# EAGLE schematic AllOfTheAbove_16nov (EAGLE 9.5.1)

## Sheet 1 of 4: Main 1-Inputs/VCAs
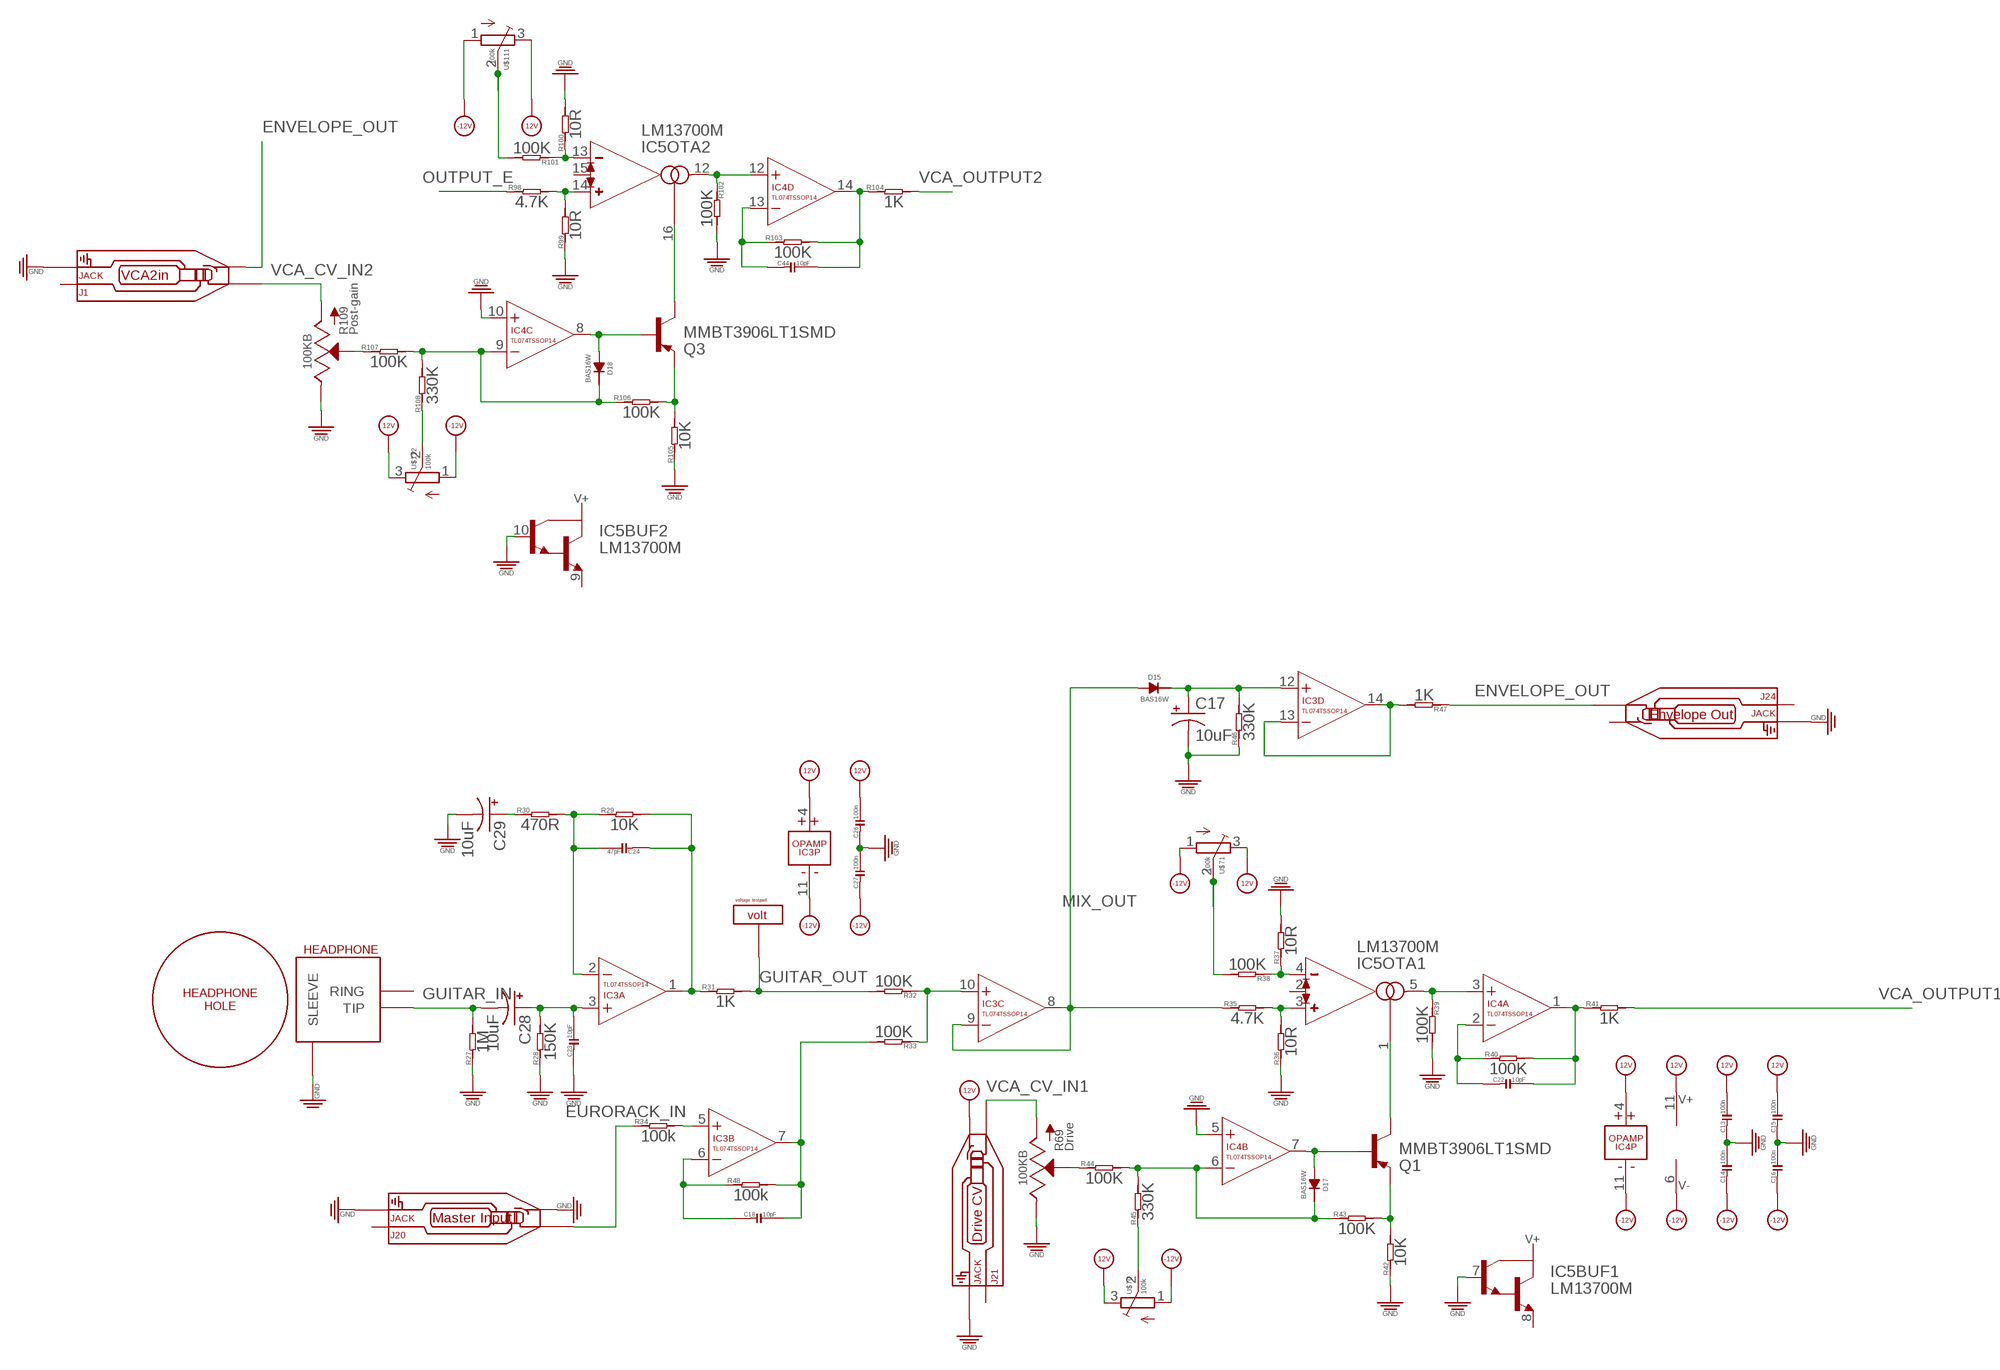
[diagram p0: schematic, sheet 1]

### Parts
C13  100n  C-0603  [C0603]
C14  100n  C-0603  [C0603]
C15  100n  C-0603  [C0603]
C16  100n  C-0603  [C0603]
C17  10uF  CPOL-US153CLV-0505  [153CLV-0505]
C18  10pF  C-0603  [C0603]
C22  10pF  C-0603  [C0603]
C23  10pF  C-0603  [C0603]
C24  47pF  C-0603  [C0603]
C26  100n  C-0603  [C0603]
C27  100n  C-0603  [C0603]
C28  10uF  CPOL-US153CLV-0505  [153CLV-0505]
C29  10uF  CPOL-US153CLV-0505  [153CLV-0505]
C44  10pF  C-0603  [C0603]
D15  BAS16W  [SOT-323]
D17  BAS16W  [SOT-323]
D18  BAS16W  [SOT-323]
IC3  TL074TSSOP14  [TSSOP14]
IC4  TL074TSSOP14  [TSSOP14]
IC5  LM13700M  [SO16]
J1  JACK  AUDIO-JACK_SMALLSYMBOLNODRILL  [3.5MM-JACK-SWITCH-13MM-NOHOLES]
J20  JACK  AUDIO-JACK_SMALLSYMBOLNODRILL  [3.5MM-JACK-SWITCH-13MM-NOHOLES]
J21  JACK  AUDIO-JACK_SMALLSYMBOLNODRILL  [3.5MM-JACK-SWITCH-13MM-NOHOLES]
J24  JACK  AUDIO-JACK_SMALLSYMBOLNODRILL  [3.5MM-JACK-SWITCH-13MM-NOHOLES]
Q1  MMBT3906LT1SMD  [SOT23-BEC]
Q3  MMBT3906LT1SMD  [SOT23-BEC]
R27  1M  R-0603  [R0603]
R28  150K  R-0603  [R0603]
R29  10K  R-0603  [R0603]
R30  470R  R-0603  [R0603]
R31  1K  R-0603  [R0603]
R32  100K  R-0603  [R0603]
R33  100K  R-0603  [R0603]
R34  100k  R-0603  [R0603]
R35  4.7K  R-0603  [R0603]
R36  10R  R-0603  [R0603]
R37  10R  R-0603  [R0603]
R38  100K  R-0603  [R0603]
R39  100K  R-0603  [R0603]
R40  100K  R-0603  [R0603]
R41  1K  R-0603  [R0603]
R42  10K  R-0603  [R0603]
R43  100K  R-0603  [R0603]
R44  100K  R-0603  [R0603]
R45  330K  R-0603  [R0603]
R46  330K  R-0603  [R0603]
R47  1K  R-0603  [R0603]
R48  100k  R-0603  [R0603]
R69  100KB  POTSQUAREHOLE_SMALLKNOB  [ALPS_POT_SQUAREHOLES]
R98  4.7K  R-0603  [R0603]
R99  10R  R-0603  [R0603]
R100  10R  R-0603  [R0603]
R101  100K  R-0603  [R0603]
R102  100K  R-0603  [R0603]
R103  100K  R-0603  [R0603]
R104  1K  R-0603  [R0603]
R105  10K  R-0603  [R0603]
R106  100K  R-0603  [R0603]
R107  100K  R-0603  [R0603]
R108  330K  R-0603  [R0603]
R109  100KB  POTSQUAREHOLE_SMALLKNOB  [ALPS_POT_SQUAREHOLES]
U$15  VOLTAGETESTPAD  [POWERTESTPAD]
U$23  HEADPHONEHOLE_BIGGAP  [HEADPHONEHOLE_GAP]
U$68  HEADPHONE  [2X3-SHROUDED]
U$70  100k  TRIMPOTTC33X  [TC33X]
U$71  100k  TRIMPOTTC33X  [TC33X]
U$111  100k  TRIMPOTTC33X  [TC33X]
U$112  100k  TRIMPOTTC33X  [TC33X]

### Nets
12V [power]: C13.2 C15.2 C26.2 IC3.4(P:V+) IC4.4(P:V+) IC5.11(SUPPLY:V+) J21.SWITCH_B@1(SWITCH) J21.SWITCH_T@3(SWITCH) U$70.3(E) U$71.3(E) U$111.3(E) U$112.3(E) ; also sheet 2,3,4
-12V [power]: C14.1 C16.1 C27.1 IC3.11(P:V-) IC4.11(P:V-) IC5.6(SUPPLY:V-) U$70.1(A) U$71.1(A) U$111.1(A) U$112.1(A) ; also sheet 2,3,4
ENVELOPE_OUT: J1.SWITCH_B@1(SWITCH) J1.SWITCH_T@3(SWITCH) J24.TIP_B@1(TIP) J24.TIP_T@3(TIP) R47.1 ; also sheet 2
EURORACK_IN: J20.TIP_B@1(TIP) J20.TIP_T@3(TIP) R34.1
GND [power]: C13.1 C14.2 C15.1 C16.2 C17.- C23.1 C26.1 C27.2 C29.- IC4.5(B:+IN) IC4.10(C:+IN) IC5.7(BUF1:B) IC5.10(BUF2:B) J1.RING_B@1(RING) J1.RING_T@3(RING) J20.RING_B@1(RING) J20.RING_T@3(RING) J20.SWITCH_B@1(SWITCH) J20.SWITCH_T@3(SWITCH) J21.RING_B@1(RING) J21.RING_T@3(RING) J24.RING_B@1(RING) J24.RING_T@3(RING) R27.1 R28.1 R36.1 R37.2 R39.2 R42.1 R46.1 R69.P$1(E) R99.1 R100.2 R102.2 R105.1 R109.P$1(E) U$68.3(SLEEVE) U$68.4(SLEEVE) ; also sheet 2,3,4
GUITAR_IN: C28.- R27.2 U$68.5(TIP) U$68.6(TIP)
GUITAR_OUT: R31.2 R32.2 U$15.P$1(VOLTAGE) U$15.P$2(VOLTAGE) U$15.P$3(VOLTAGE)
MIX_OUT: D15.ANODE IC3.8(C:OUT) IC3.9(C:-IN) R35.1
N$14: C23.2 C28.+ IC3.3(A:+IN) R28.2
N$17: C24.1 IC3.1(A:OUT) R29.2 R31.1
N$44: C24.2 IC3.2(A:-IN) R29.1 R30.2
N$45: C29.+ R30.1
N$46: C18.2 IC3.7(B:OUT) R33.2 R48.2
N$47: IC3.5(B:+IN) R34.2
N$48: IC5.4(OTA1:IN_N) R37.1 R38.1
N$49: IC5.3(OTA1:IN_P) R35.2 R36.2
N$50: IC4.3(A:+IN) IC5.5(OTA1:OUT) R39.1
N$51: C22.1 IC4.2(A:-IN) R40.1
N$52: C22.2 IC4.1(A:OUT) R40.2 R41.1
N$53: R38.2 U$71.2(S)
N$54: D17.ANODE IC4.7(B:OUT) Q1.B
N$55: D17.CATHODE IC4.6(B:-IN) R43.1 R44.2 R45.2
N$56: Q1.E R42.2 R43.2
N$57: IC5.1(OTA1:I_BIAS) Q1.C
N$58: R45.1 U$70.2(S)
N$59: R44.1 R69.P$2(S)
N$60: IC3.13(D:-IN) IC3.14(D:OUT) R47.2
N$61: C17.+ D15.CATHODE IC3.12(D:+IN) R46.2
N$62: C18.1 IC3.6(B:-IN) R48.1
N$106: IC5.13(OTA2:IN_N) R100.1 R101.1
N$107: IC5.14(OTA2:IN_P) R98.2 R99.2
N$108: IC4.12(D:+IN) IC5.12(OTA2:OUT) R102.1
N$109: C44.1 IC4.13(D:-IN) R103.1
N$110: C44.2 IC4.14(D:OUT) R103.2 R104.1
N$111: R101.2 U$111.2(S)
N$112: D18.ANODE IC4.8(C:OUT) Q3.B
N$113: D18.CATHODE IC4.9(C:-IN) R106.1 R107.2 R108.2
N$114: Q3.E R105.2 R106.2
N$115: IC5.16(OTA2:I_BIAS) Q3.C
N$116: R108.1 U$112.2(S)
N$117: R107.1 R109.P$2(S)
OUTPUT_E: R98.1 ; also sheet 2
VCA_CV_IN1: J21.TIP_B@1(TIP) J21.TIP_T@3(TIP) R69.P$3(A)
VCA_CV_IN2: J1.TIP_B@1(TIP) J1.TIP_T@3(TIP) R109.P$3(A)
VCA_OUTPUT1: R41.2 ; also sheet 2,3
VCA_OUTPUT2: R104.2 ; also sheet 2,3
VCA_SIG_IN: IC3.10(C:+IN) R32.1 R33.1
Unconnected: IC5.2(OTA1:I_DIODE) IC5.8(BUF1:E) IC5.9(BUF2:E) IC5.15(OTA2:I_DIODE) J1.SECOND_B@1(SECOND) J1.SECOND_T@3(SECOND) J20.SECOND_B@1(SECOND) J20.SECOND_T@3(SECOND) J21.SECOND_B@1(SECOND) J21.SECOND_T@3(SECOND) J24.SECOND_B@1(SECOND) J24.SECOND_T@3(SECOND) J24.SWITCH_B@1(SWITCH) J24.SWITCH_T@3(SWITCH) U$68.1(RING) U$68.2(RING)

## Sheet 2 of 4: Main 2-Pedals/Outputs
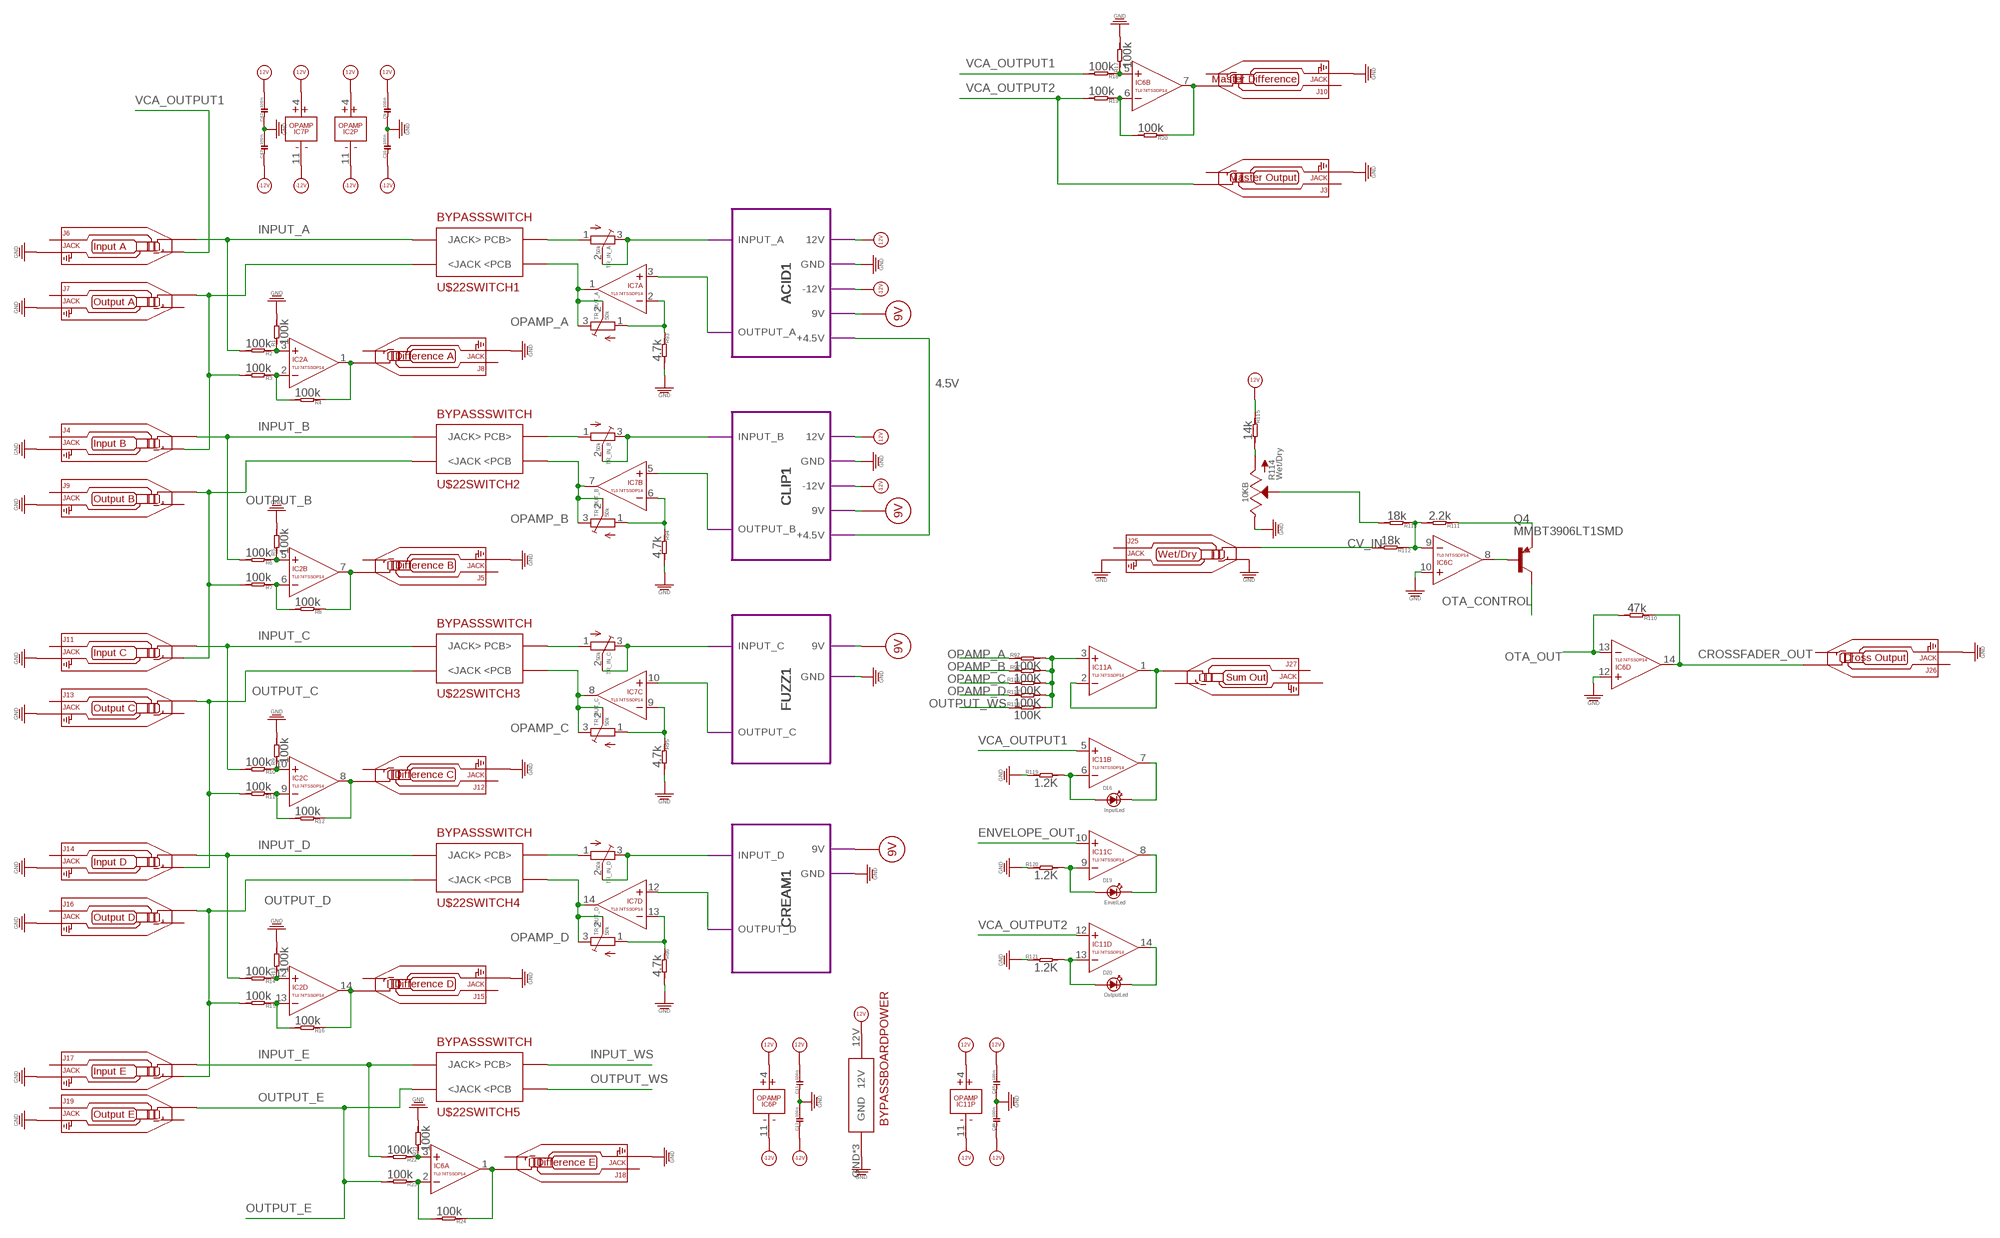
[diagram p1: schematic, sheet 2]

### Parts
C9  100n  C-0603  [C0603]
C10  100n  C-0603  [C0603]
C11  100n  C-0603  [C0603]
C12  100n  C-0603  [C0603]
C42  100n  C-0603  [C0603]
C43  100n  C-0603  [C0603]
C45  100n  C-0603  [C0603]
C46  100n  C-0603  [C0603]
D16  LED3MM  [3MMLED]
D19  LED3MM  [3MMLED]
D20  LED3MM  [3MMLED]
IC2  TL074TSSOP14  [TSSOP14]
IC6  TL074TSSOP14  [TSSOP14]
IC7  TL074TSSOP14  [TSSOP14]
IC11  TL074TSSOP14  [TSSOP14]
J3  JACK  AUDIO-JACK_SMALLSYMBOLNODRILL  [3.5MM-JACK-SWITCH-13MM-NOHOLES]
J4  JACK  AUDIO-JACK_SMALLSYMBOLNODRILL  [3.5MM-JACK-SWITCH-13MM-NOHOLES]
J5  JACK  AUDIO-JACK_SMALLSYMBOLNODRILL  [3.5MM-JACK-SWITCH-13MM-NOHOLES]
J6  JACK  AUDIO-JACK_SMALLSYMBOLNODRILL  [3.5MM-JACK-SWITCH-13MM-NOHOLES]
J7  JACK  AUDIO-JACK_SMALLSYMBOLNODRILL  [3.5MM-JACK-SWITCH-13MM-NOHOLES]
J8  JACK  AUDIO-JACK_SMALLSYMBOLNODRILL  [3.5MM-JACK-SWITCH-13MM-NOHOLES]
J9  JACK  AUDIO-JACK_SMALLSYMBOLNODRILL  [3.5MM-JACK-SWITCH-13MM-NOHOLES]
J10  JACK  AUDIO-JACK_SMALLSYMBOLNODRILL  [3.5MM-JACK-SWITCH-13MM-NOHOLES]
J11  JACK  AUDIO-JACK_SMALLSYMBOLNODRILL  [3.5MM-JACK-SWITCH-13MM-NOHOLES]
J12  JACK  AUDIO-JACK_SMALLSYMBOLNODRILL  [3.5MM-JACK-SWITCH-13MM-NOHOLES]
J13  JACK  AUDIO-JACK_SMALLSYMBOLNODRILL  [3.5MM-JACK-SWITCH-13MM-NOHOLES]
J14  JACK  AUDIO-JACK_SMALLSYMBOLNODRILL  [3.5MM-JACK-SWITCH-13MM-NOHOLES]
J15  JACK  AUDIO-JACK_SMALLSYMBOLNODRILL  [3.5MM-JACK-SWITCH-13MM-NOHOLES]
J16  JACK  AUDIO-JACK_SMALLSYMBOLNODRILL  [3.5MM-JACK-SWITCH-13MM-NOHOLES]
J17  JACK  AUDIO-JACK_SMALLSYMBOLNODRILL  [3.5MM-JACK-SWITCH-13MM-NOHOLES]
J18  JACK  AUDIO-JACK_SMALLSYMBOLNODRILL  [3.5MM-JACK-SWITCH-13MM-NOHOLES]
J19  JACK  AUDIO-JACK_SMALLSYMBOLNODRILL  [3.5MM-JACK-SWITCH-13MM-NOHOLES]
J25  JACK  AUDIO-JACK_SMALLSYMBOLNODRILL  [3.5MM-JACK-SWITCH-13MM-NOHOLES]
J26  JACK  AUDIO-JACK_SMALLSYMBOLNODRILL  [3.5MM-JACK-SWITCH-13MM-NOHOLES]
J27  JACK  AUDIO-JACK_SMALLSYMBOLNODRILL  [3.5MM-JACK-SWITCH-13MM-NOHOLES]
Q4  MMBT3906LT1SMD  [SOT23-BEC]
R1  100k  R-0603  [R0603]
R2  100k  R-0603  [R0603]
R3  100k  R-0603  [R0603]
R4  100k  R-0603  [R0603]
R5  100k  R-0603  [R0603]
R6  100k  R-0603  [R0603]
R7  100k  R-0603  [R0603]
R8  100k  R-0603  [R0603]
R9  100k  R-0603  [R0603]
R10  100k  R-0603  [R0603]
R11  100k  R-0603  [R0603]
R12  100k  R-0603  [R0603]
R13  100k  R-0603  [R0603]
R14  100k  R-0603  [R0603]
R15  100k  R-0603  [R0603]
R16  100k  R-0603  [R0603]
R17  100k  R-0603  [R0603]
R18  100k  R-0603  [R0603]
R19  100k  R-0603  [R0603]
R20  100k  R-0603  [R0603]
R21  100k  R-0603  [R0603]
R22  100k  R-0603  [R0603]
R23  100k  R-0603  [R0603]
R24  100k  R-0603  [R0603]
R92  100K  R-0603  [R0603]
R93  4.7k  R-0603  [R0603]
R94  4.7k  R-0603  [R0603]
R95  4.7k  R-0603  [R0603]
R96  4.7k  R-0603  [R0603]
R97  100K  R-0603  [R0603]
R110  47k  R-0603  [R0603]
R111  2.2k  R-0603  [R0603]
R112  18k  R-0603  [R0603]
R113  18k  R-0603  [R0603]
R114  10KB  POTSQUAREHOLE_SMALLKNOB  [ALPS_POT_SQUAREHOLES]
R115  14k  R-0603  [R0603]
R116  100K  R-0603  [R0603]
R117  100K  R-0603  [R0603]
R118  100K  R-0603  [R0603]
R119  1.2K  R-0603  [R0603]
R120  1.2K  R-0603  [R0603]
R121  1.2K  R-0603  [R0603]
TR_IN_A  50k  TRIMPOTTC33X  [TC33X]
TR_IN_B  50k  TRIMPOTTC33X  [TC33X]
TR_IN_C  50k  TRIMPOTTC33X  [TC33X]
TR_IN_D  50k  TRIMPOTTC33X  [TC33X]
TR_OUT_A  50k  TRIMPOTTC33X  [TC33X]
TR_OUT_B  50k  TRIMPOTTC33X  [TC33X]
TR_OUT_C  50k  TRIMPOTTC33X  [TC33X]
TR_OUT_D  50k  TRIMPOTTC33X  [TC33X]
U$22  5STOMPBOARD  [BYPASSBOARD]

### Module instances
ACID1 = ACID
CLIP1 = CLIP
FUZZ1 = FUZZ
CREAM1 = CREAM

### Nets
4.5V [power]: port ACID1.+4.5V CLIP1.+4.5V ; also sheet 4
9V [power]: port ACID1.9V CLIP1.9V FUZZ1.9V CREAM1.9V ; also sheet 4
12V [power]: C9.2 C11.2 C42.2 C45.2 IC2.4(P:V+) IC6.4(P:V+) IC7.4(P:V+) IC11.4(P:V+) R115.1 U$22.12V ; port CLIP1.12V ACID1.12V ; also sheet 1,3,4
-12V [power]: C10.1 C12.1 C43.1 C46.1 IC2.11(P:V-) IC6.11(P:V-) IC7.11(P:V-) IC11.11(P:V-) ; port CLIP1.-12V ACID1.-12V ; also sheet 1,3,4
CROSSFADER_OUT: IC6.14(D:OUT) J26.TIP_B@1(TIP) J26.TIP_T@3(TIP) R110.1
CV_IN: J25.TIP_B@1(TIP) J25.TIP_T@3(TIP) R112.2
ENVELOPE_OUT: IC11.10(C:+IN) ; also sheet 1
GND [power]: C9.1 C10.2 C11.1 C12.2 C42.1 C43.2 C45.1 C46.2 IC6.10(C:+IN) IC6.12(D:+IN) J3.RING_B@1(RING) J3.RING_T@3(RING) J4.RING_B@1(RING) J4.RING_T@3(RING) J5.RING_B@1(RING) J5.RING_T@3(RING) J6.RING_B@1(RING) J6.RING_T@3(RING) J7.RING_B@1(RING) J7.RING_T@3(RING) J8.RING_B@1(RING) J8.RING_T@3(RING) J9.RING_B@1(RING) J9.RING_T@3(RING) J10.RING_B@1(RING) J10.RING_T@3(RING) J11.RING_B@1(RING) J11.RING_T@3(RING) J12.RING_B@1(RING) J12.RING_T@3(RING) J13.RING_B@1(RING) J13.RING_T@3(RING) J14.RING_B@1(RING) J14.RING_T@3(RING) J15.RING_B@1(RING) J15.RING_T@3(RING) J16.RING_B@1(RING) J16.RING_T@3(RING) J17.RING_B@1(RING) J17.RING_T@3(RING) J18.RING_B@1(RING) J18.RING_T@3(RING) J19.RING_B@1(RING) J19.RING_T@3(RING) J25.RING_B@1(RING) J25.RING_T@3(RING) J25.SWITCH_B@1(SWITCH) J25.SWITCH_T@3(SWITCH) J26.RING_B@1(RING) J26.RING_T@3(RING) R1.2 R5.2 R9.2 R13.2 R17.2 R21.2 R93.2 R94.2 R95.2 R96.2 R114.P$1(E) R119.1 R120.1 R121.1 U$22.GND U$22.GND2(GND) U$22.GND3(GND) ; port ACID1.GND CLIP1.GND FUZZ1.GND CREAM1.GND ; also sheet 1,3,4
INPUT_A: J6.TIP_B@1(TIP) J6.TIP_T@3(TIP) R2.2 U$22.P$3(SWITCH1:JACK>)
INPUT_B: J4.TIP_B@1(TIP) J4.TIP_T@3(TIP) R6.2 U$22.P$7(SWITCH2:JACK>)
INPUT_C: J11.TIP_B@1(TIP) J11.TIP_T@3(TIP) R10.2 U$22.P$11(SWITCH3:JACK>)
INPUT_D: J14.TIP_B@1(TIP) J14.TIP_T@3(TIP) R14.2 U$22.P$15(SWITCH4:JACK>)
INPUT_E: J17.TIP_B@1(TIP) J17.TIP_T@3(TIP) R22.2 U$22.P$19(SWITCH5:JACK>)
INPUT_WS: U$22.P$20(SWITCH5:PCB>) ; also sheet 3
N$1: IC7.2(A:-IN) R93.1 TR_OUT_A.1(A)
N$4: IC11.1(A:OUT) IC11.2(A:-IN) J27.TIP_B@1(TIP) J27.TIP_T@3(TIP)
N$5: TR_IN_A.1(A) U$22.P$4(SWITCH1:PCB>)
N$6: IC7.3(A:+IN) ; port ACID1.OUTPUT_A
N$7: TR_IN_B.1(A) U$22.P$8(SWITCH2:PCB>)
N$8: TR_IN_C.1(A) U$22.P$12(SWITCH3:PCB>)
N$9: TR_IN_C.2(S) TR_IN_C.3(E) ; port FUZZ1.INPUT_C
N$10: IC11.3(A:+IN) R92.2 R97.2 R116.2 R117.2 R118.2
N$11: IC7.9(C:-IN) R95.1 TR_OUT_C.1(A)
N$12: TR_IN_B.2(S) TR_IN_B.3(E) ; port CLIP1.INPUT_B
N$13: D16.+ IC11.6(B:-IN) R119.2
N$15: IC2.3(A:+IN) R1.1 R2.1
N$16: IC6.9(C:-IN) R111.2 R112.1 R113.1
N$18: IC2.1(A:OUT) J8.TIP_B@1(TIP) J8.TIP_T@3(TIP) R4.1
N$19: IC2.5(B:+IN) R5.1 R6.1
N$20: IC2.6(B:-IN) R7.1 R8.2
N$21: Q4.E R111.1
N$22: IC6.8(C:OUT) Q4.B
N$23: IC2.7(B:OUT) J5.TIP_B@1(TIP) J5.TIP_T@3(TIP) R8.1
N$24: IC2.10(C:+IN) R9.1 R10.1
N$25: IC2.9(C:-IN) R11.1 R12.2
N$26: R114.P$3(A) R115.2
N$27: R113.2 R114.P$2(S)
N$28: IC2.8(C:OUT) J12.TIP_B@1(TIP) J12.TIP_T@3(TIP) R12.1
N$29: IC2.12(D:+IN) R13.1 R14.1
N$30: IC2.13(D:-IN) R15.1 R16.2
N$31: IC7.6(B:-IN) R94.1 TR_OUT_B.1(A)
N$32: D16.- IC11.7(B:OUT)
N$33: IC2.14(D:OUT) J15.TIP_B@1(TIP) J15.TIP_T@3(TIP) R16.1
N$34: IC6.5(B:+IN) R17.1 R18.1
N$35: IC6.6(B:-IN) R19.1 R20.2
N$36: D19.+ IC11.9(C:-IN) R120.2
N$37: IC7.5(B:+IN) ; port CLIP1.OUTPUT_B
N$38: IC6.7(B:OUT) J10.TIP_B@1(TIP) J10.TIP_T@3(TIP) R20.1
N$39: IC6.3(A:+IN) R21.1 R22.1
N$40: IC6.2(A:-IN) R23.1 R24.2
N$41: TR_IN_A.2(S) TR_IN_A.3(E) ; port ACID1.INPUT_A
N$42: D19.- IC11.8(C:OUT)
N$43: IC6.1(A:OUT) J18.TIP_B@1(TIP) J18.TIP_T@3(TIP) R24.1
N$99: TR_IN_D.1(A) U$22.P$16(SWITCH4:PCB>)
N$100: TR_IN_D.2(S) TR_IN_D.3(E) ; port CREAM1.INPUT_D
N$101: IC7.13(D:-IN) R96.1 TR_OUT_D.1(A)
N$102: IC7.12(D:+IN) ; port CREAM1.OUTPUT_D
N$103: IC7.10(C:+IN) ; port FUZZ1.OUTPUT_C
N$104: D20.+ IC11.13(D:-IN) R121.2
N$105: D20.- IC11.14(D:OUT)
N$118: IC2.2(A:-IN) R3.1 R4.2
OPAMP_A: IC7.1(A:OUT) R92.1 TR_OUT_A.2(S) TR_OUT_A.3(E) U$22.P$2(SWITCH1:<PCB)
OPAMP_B: IC7.7(B:OUT) R97.1 TR_OUT_B.2(S) TR_OUT_B.3(E) U$22.P$6(SWITCH2:<PCB)
OPAMP_C: IC7.8(C:OUT) R116.1 TR_OUT_C.2(S) TR_OUT_C.3(E) U$22.P$10(SWITCH3:<PCB)
OPAMP_D: IC7.14(D:OUT) R117.1 TR_OUT_D.2(S) TR_OUT_D.3(E) U$22.P$14(SWITCH4:<PCB)
OTA_CONTROL: Q4.C ; also sheet 3
OTA_OUT: IC6.13(D:-IN) R110.2 ; also sheet 3
OUTPUT_A: J4.SWITCH_B@1(SWITCH) J4.SWITCH_T@3(SWITCH) J7.TIP_B@1(TIP) J7.TIP_T@3(TIP) R3.2 U$22.P$1(SWITCH1:<JACK)
OUTPUT_B: J9.TIP_B@1(TIP) J9.TIP_T@3(TIP) J11.SWITCH_B@1(SWITCH) J11.SWITCH_T@3(SWITCH) R7.2 U$22.P$5(SWITCH2:<JACK)
OUTPUT_C: J13.TIP_B@1(TIP) J13.TIP_T@3(TIP) J14.SWITCH_B@1(SWITCH) J14.SWITCH_T@3(SWITCH) R11.2 U$22.P$9(SWITCH3:<JACK)
OUTPUT_D: J16.TIP_B@1(TIP) J16.TIP_T@3(TIP) J17.SWITCH_B@1(SWITCH) J17.SWITCH_T@3(SWITCH) R15.2 U$22.P$13(SWITCH4:<JACK)
OUTPUT_E: J19.TIP_B@1(TIP) J19.TIP_T@3(TIP) R23.2 U$22.P$17(SWITCH5:<JACK) ; also sheet 1
OUTPUT_WS: R118.1 U$22.P$18(SWITCH5:<PCB) ; also sheet 3
VCA_OUTPUT1: IC11.5(B:+IN) J6.SWITCH_B@1(SWITCH) J6.SWITCH_T@3(SWITCH) R18.2 ; also sheet 1,3
VCA_OUTPUT2: IC11.12(D:+IN) J3.TIP_B@1(TIP) J3.TIP_T@3(TIP) R19.2 ; also sheet 1,3
Unconnected: J3.SECOND_B@1(SECOND) J3.SECOND_T@3(SECOND) J3.SWITCH_B@1(SWITCH) J3.SWITCH_T@3(SWITCH) J4.SECOND_B@1(SECOND) J4.SECOND_T@3(SECOND) J5.SECOND_B@1(SECOND) J5.SECOND_T@3(SECOND) J5.SWITCH_B@1(SWITCH) J5.SWITCH_T@3(SWITCH) J6.SECOND_B@1(SECOND) J6.SECOND_T@3(SECOND) J7.SECOND_B@1(SECOND) J7.SECOND_T@3(SECOND) J7.SWITCH_B@1(SWITCH) J7.SWITCH_T@3(SWITCH) J8.SECOND_B@1(SECOND) J8.SECOND_T@3(SECOND) J8.SWITCH_B@1(SWITCH) J8.SWITCH_T@3(SWITCH) J9.SECOND_B@1(SECOND) J9.SECOND_T@3(SECOND) J9.SWITCH_B@1(SWITCH) J9.SWITCH_T@3(SWITCH) J10.SECOND_B@1(SECOND) J10.SECOND_T@3(SECOND) J10.SWITCH_B@1(SWITCH) J10.SWITCH_T@3(SWITCH) J11.SECOND_B@1(SECOND) J11.SECOND_T@3(SECOND) J12.SECOND_B@1(SECOND) J12.SECOND_T@3(SECOND) J12.SWITCH_B@1(SWITCH) J12.SWITCH_T@3(SWITCH) J13.SECOND_B@1(SECOND) J13.SECOND_T@3(SECOND) J13.SWITCH_B@1(SWITCH) J13.SWITCH_T@3(SWITCH) J14.SECOND_B@1(SECOND) J14.SECOND_T@3(SECOND) J15.SECOND_B@1(SECOND) J15.SECOND_T@3(SECOND) J15.SWITCH_B@1(SWITCH) J15.SWITCH_T@3(SWITCH) J16.SECOND_B@1(SECOND) J16.SECOND_T@3(SECOND) J16.SWITCH_B@1(SWITCH) J16.SWITCH_T@3(SWITCH) J17.SECOND_B@1(SECOND) J17.SECOND_T@3(SECOND) J18.SECOND_B@1(SECOND) J18.SECOND_T@3(SECOND) J18.SWITCH_B@1(SWITCH) J18.SWITCH_T@3(SWITCH) J19.SECOND_B@1(SECOND) J19.SECOND_T@3(SECOND) J19.SWITCH_B@1(SWITCH) J19.SWITCH_T@3(SWITCH) J25.SECOND_B@1(SECOND) J25.SECOND_T@3(SECOND) J26.SECOND_B@1(SECOND) J26.SECOND_T@3(SECOND) J26.SWITCH_B@1(SWITCH) J26.SWITCH_T@3(SWITCH) J27.RING_B@1(RING) J27.RING_T@3(RING) J27.SECOND_B@1(SECOND) J27.SECOND_T@3(SECOND) J27.SWITCH_B@1(SWITCH) J27.SWITCH_T@3(SWITCH)

## Sheet 3 of 4: Main 3-Folder/Crossfader
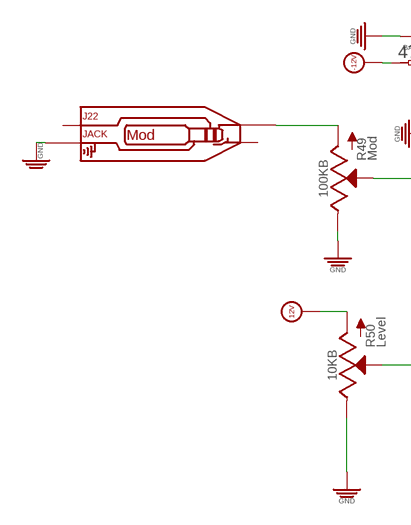
[diagram p2: schematic, sheet 3, part 1 of 3]
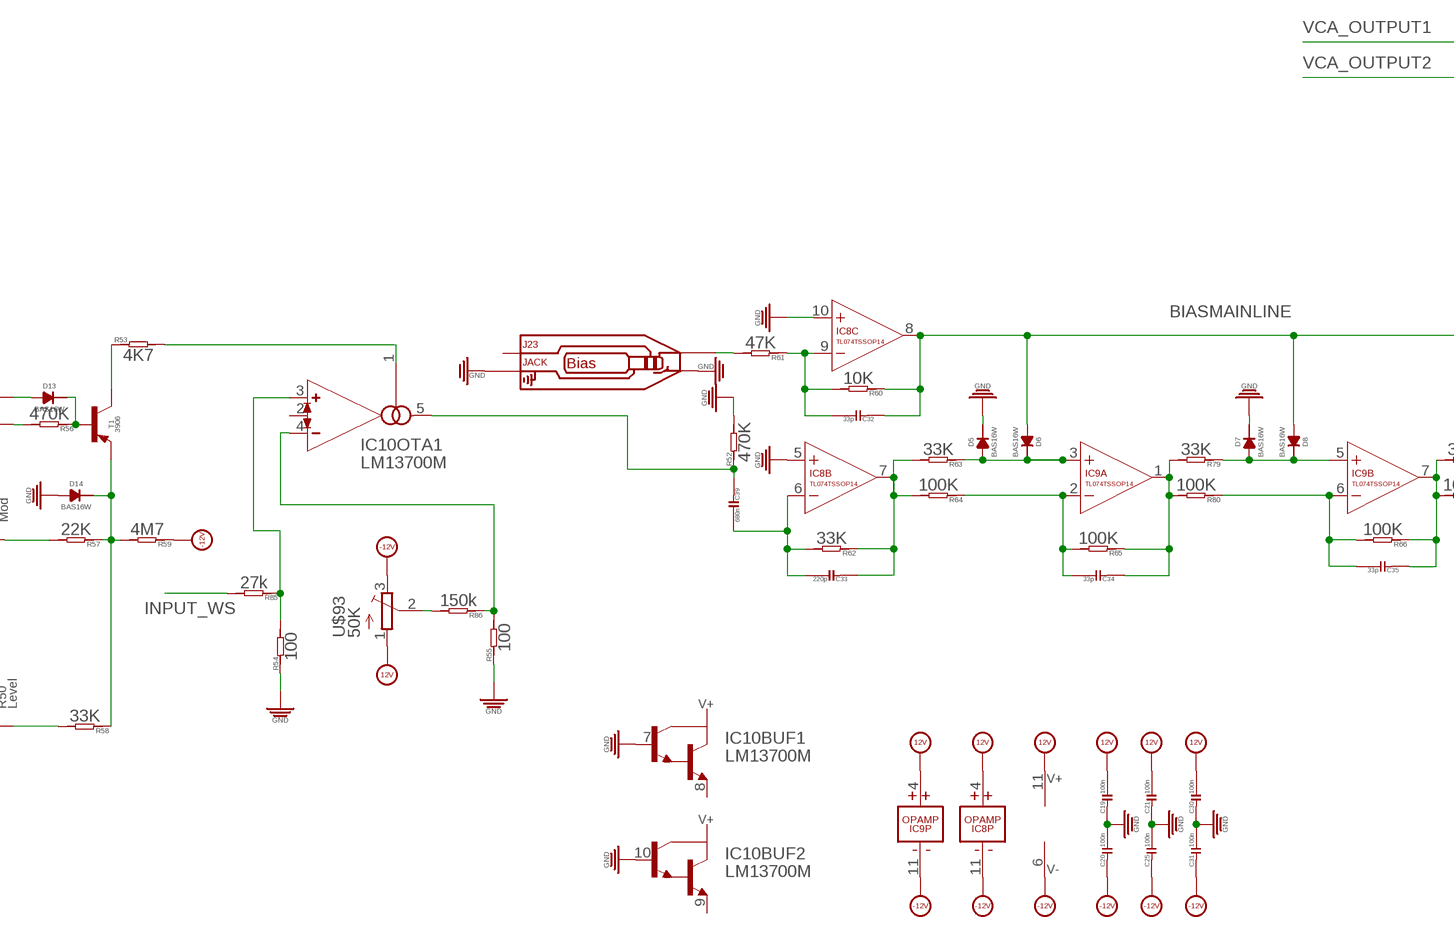
[diagram p3: schematic, sheet 3, part 2 of 3]
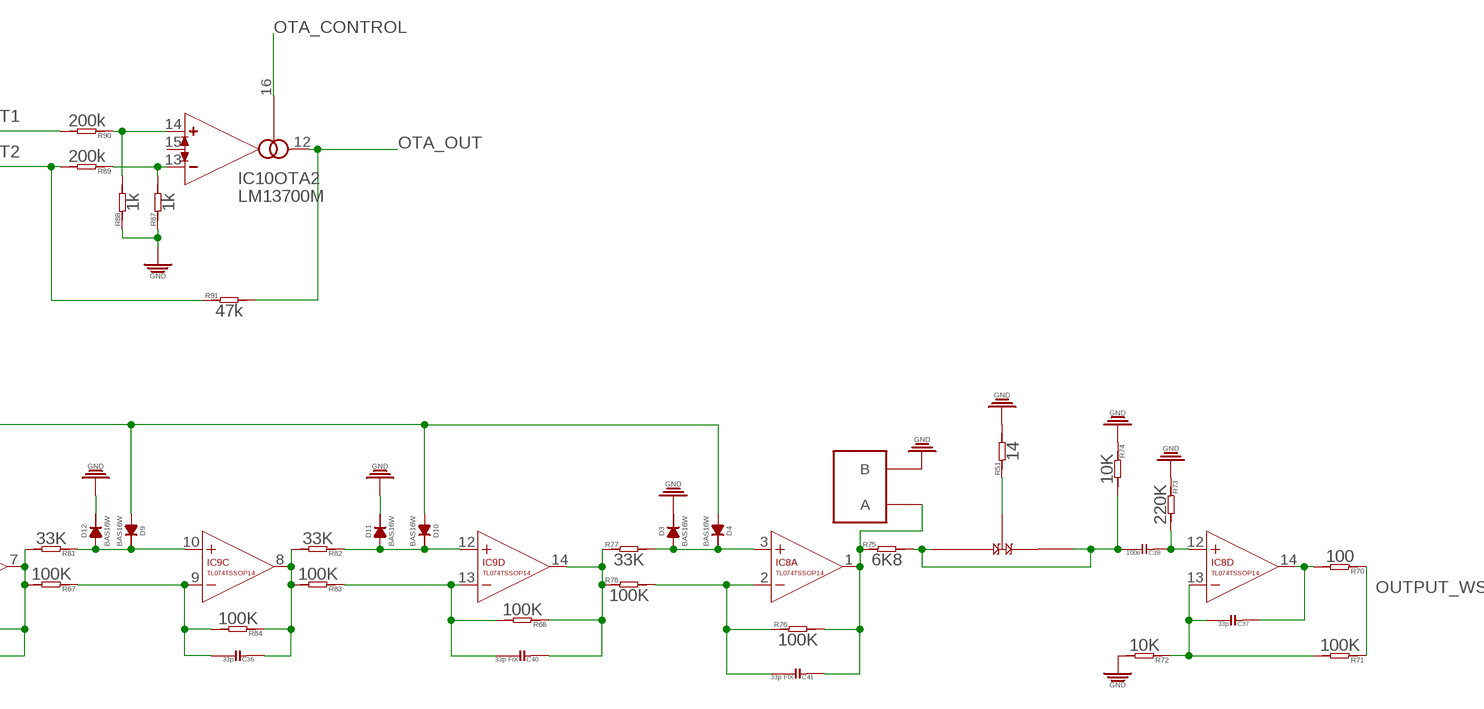
[diagram p4: schematic, sheet 3, part 3 of 3]

### Parts
C19  100n  C-0603  [C0603]
C20  100n  C-0603  [C0603]
C21  100n  C-0603  [C0603]
C25  100n  C-0603  [C0603]
C30  100n  C-0603  [C0603]
C31  100n  C-0603  [C0603]
C32  33p  C-0603  [C0603]
C33  220p  C-0603  [C0603]
C34  33p  C-0603  [C0603]
C35  33p  C-0603  [C0603]
C36  33p  C-0603  [C0603]
C37  33p  C-0603  [C0603]
C38  100n  C-0603  [C0603]
C39  680n  C-0603  [C0603]
C40  33p FIX  C-0603  [C0603]
C41  33p FIX  C-0603  [C0603]
D3  BAS16W  [SOT-323]
D4  BAS16W  [SOT-323]
D5  BAS16W  [SOT-323]
D6  BAS16W  [SOT-323]
D7  BAS16W  [SOT-323]
D8  BAS16W  [SOT-323]
D9  BAS16W  [SOT-323]
D10  BAS16W  [SOT-323]
D11  BAS16W  [SOT-323]
D12  BAS16W  [SOT-323]
D13  BAS16W  [SOT-323]
D14  BAS16W  [SOT-323]
IC8  TL074TSSOP14  [TSSOP14]
IC9  TL074TSSOP14  [TSSOP14]
IC10  LM13700M  [SO16]
J22  JACK  AUDIO-JACK_SMALLSYMBOLNODRILL  [3.5MM-JACK-SWITCH-13MM-NOHOLES]
J23  JACK  AUDIO-JACK_SMALLSYMBOLNODRILL  [3.5MM-JACK-SWITCH-13MM-NOHOLES]
R49  100KB  POTSQUAREHOLE_SMALLKNOB  [ALPS_POT_SQUAREHOLES]
R50  10KB  POTSQUAREHOLE_SMALLKNOB  [ALPS_POT_SQUAREHOLES]
R51  14  R-0603  [R0603]
R52  470K  R-0603  [R0603]
R53  4K7  R-0603  [R0603]
R54  100  R-0603  [R0603]
R55  100  R-0603  [R0603]
R56  470K  R-0603  [R0603]
R57  22K  R-0603  [R0603]
R58  33K  R-0603  [R0603]
R59  4M7  R-0603  [R0603]
R60  10K  R-0603  [R0603]
R61  47K  R-0603  [R0603]
R62  33K  R-0603  [R0603]
R63  33K  R-0603  [R0603]
R64  100K  R-0603  [R0603]
R65  100K  R-0603  [R0603]
R66  100K  R-0603  [R0603]
R67  100K  R-0603  [R0603]
R68  100K  R-0603  [R0603]
R70  100  R-0603  [R0603]
R71  100K  R-0603  [R0603]
R72  10K  R-0603  [R0603]
R73  220K  R-0603  [R0603]
R74  10K  R-0603  [R0603]
R75  6K8  R-0603  [R0603]
R76  100K  R-0603  [R0603]
R77  33K  R-0603  [R0603]
R78  100K  R-0603  [R0603]
R79  33K  R-0603  [R0603]
R80  100K  R-0603  [R0603]
R81  33K  R-0603  [R0603]
R82  33K  R-0603  [R0603]
R83  100K  R-0603  [R0603]
R84  100K  R-0603  [R0603]
R85  27k  R-0603  [R0603]
R86  150k  R-0603  [R0603]
R87  1k  R-0603  [R0603]
R88  1k  R-0603  [R0603]
R89  200k  R-0603  [R0603]
R90  200k  R-0603  [R0603]
R91  47k  R-0603  [R0603]
T1  3906  MMBT3906LT1-PNP-SOT23-BEC  [SOT23-BEC]
U$74  BAT54S  [SOT23]
U$92  TESTPOINT_DUAL_PTH  [TESTPAD_DUAL_PTH]
U$93  50K  TRIMPOTTC33X  [TC33X]

### Nets
12V [power]: C19.2 C21.2 C30.2 IC8.4(P:V+) IC9.4(P:V+) IC10.11(SUPPLY:V+) R50.P$3(A) U$93.1(A) ; also sheet 1,2,4
-12V [power]: C20.1 C25.1 C31.1 IC8.11(P:V-) IC9.11(P:V-) IC10.6(SUPPLY:V-) R56.2 R59.1 U$93.3(E) ; also sheet 1,2,4
BIASINPUT: J23.TIP_B@1(TIP) J23.TIP_T@3(TIP) R61.2
BIASMAINLINE: C32.1 D4.ANODE D6.ANODE D8.ANODE D9.ANODE D10.ANODE IC8.8(C:OUT) R60.1
GND [power]: C19.1 C20.2 C21.1 C25.2 C30.1 C31.2 D3.CATHODE D5.CATHODE D7.CATHODE D11.CATHODE D12.CATHODE D13.ANODE D14.ANODE IC8.5(B:+IN) IC8.10(C:+IN) IC10.7(BUF1:B) IC10.10(BUF2:B) J22.RING_B@1(RING) J22.RING_T@3(RING) J23.RING_B@1(RING) J23.RING_T@3(RING) J23.SWITCH_B@1(SWITCH) J23.SWITCH_T@3(SWITCH) R49.P$1(E) R50.P$1(E) R51.2 R52.2 R54.1 R55.1 R72.2 R73.1 R74.1 R87.1 R88.1 U$92.P$2(B) ; also sheet 1,2,4
INPUT_WS: R85.2 ; also sheet 2
N$63: R51.1 U$74.P$3
N$64: C32.2 IC8.9(C:-IN) R60.2 R61.1
N$65: R49.P$2(S) R57.2
N$66: J22.TIP_B@1(TIP) J22.TIP_T@3(TIP) R49.P$3(A)
N$67: D14.CATHODE R57.1 R58.1 R59.2 T1.E
N$68: R50.P$2(S) R58.2
N$69: C38.2 R74.2 R75.2 U$74.P$1 U$74.P$2
N$70: C33.1 IC8.7(B:OUT) R62.1 R63.2 R64.2
N$71: C33.2 C39.2 IC8.6(B:-IN) R62.2
N$72: C39.1 IC10.5(OTA1:OUT) R52.1
N$73: D5.ANODE D6.CATHODE IC9.3(A:+IN) R63.1
N$74: C34.1 IC9.1(A:OUT) R65.1 R79.2 R80.2
N$75: D7.ANODE D8.CATHODE IC9.5(B:+IN) R79.1
N$76: C34.2 IC9.2(A:-IN) R64.1 R65.2
N$77: C35.2 IC9.6(B:-IN) R66.2 R80.1
N$78: C35.1 IC9.7(B:OUT) R66.1 R67.2 R81.2
N$79: D9.CATHODE D12.ANODE IC9.10(C:+IN) R81.1
N$80: C36.1 IC9.8(C:OUT) R82.2 R83.2 R84.1
N$81: C36.2 IC9.9(C:-IN) R67.1 R84.2
N$82: D10.CATHODE D11.ANODE IC9.12(D:+IN) R82.1
N$83: C40.2 IC9.13(D:-IN) R68.2 R83.1
N$84: C40.1 IC9.14(D:OUT) R68.1 R77.1 R78.1
N$85: D3.ANODE D4.CATHODE IC8.3(A:+IN) R77.2
N$86: C41.2 IC8.2(A:-IN) R76.1 R78.2
N$87: C41.1 IC8.1(A:OUT) R75.1 R76.2 U$92.P$1(A)
N$88: C38.1 IC8.12(D:+IN) R73.2
N$89: C37.1 IC8.14(D:OUT) R70.2
N$90: C37.2 IC8.13(D:-IN) R71.2 R72.1
N$91: D13.CATHODE R56.1 T1.B
N$92: R53.1 T1.C
N$93: IC10.1(OTA1:I_BIAS) R53.2
N$94: IC10.3(OTA1:IN_P) R54.2 R85.1
N$95: R86.2 U$93.2(S)
N$96: IC10.4(OTA1:IN_N) R55.2 R86.1
N$97: IC10.13(OTA2:IN_N) R87.2 R89.1
N$98: IC10.14(OTA2:IN_P) R88.2 R90.1
OTA_CONTROL: IC10.16(OTA2:I_BIAS) ; also sheet 2
OTA_OUT: IC10.12(OTA2:OUT) R91.2 ; also sheet 2
OUTPUT_WS: R70.1 R71.1 ; also sheet 2
VCA_OUTPUT1: R90.2 ; also sheet 1,2
VCA_OUTPUT2: R89.2 R91.1 ; also sheet 1,2
Unconnected: IC10.2(OTA1:I_DIODE) IC10.8(BUF1:E) IC10.9(BUF2:E) IC10.15(OTA2:I_DIODE) J22.SECOND_B@1(SECOND) J22.SECOND_T@3(SECOND) J22.SWITCH_B@1(SWITCH) J22.SWITCH_T@3(SWITCH) J23.SECOND_B@1(SECOND) J23.SECOND_T@3(SECOND)

## Sheet 4 of 4: Power
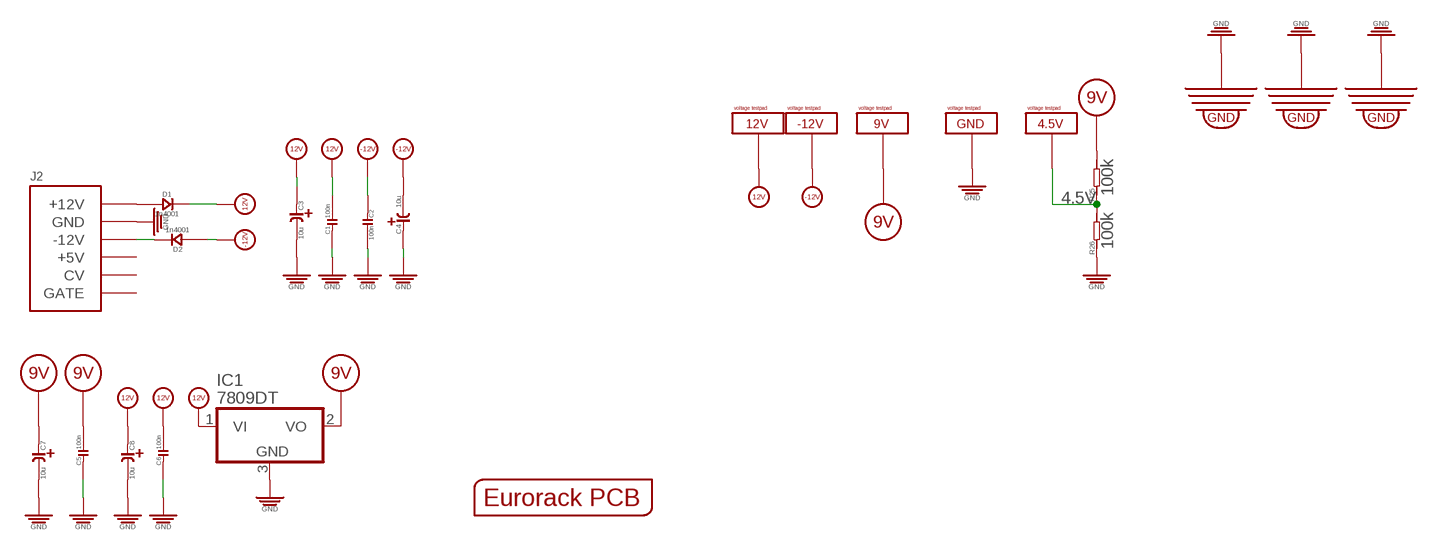
[diagram p5: schematic, sheet 4]

### Parts
C1  100n  C-0603  [C0603]
C2  100n  C-0603  [C0603]
C3  10u  C-POLAR-A  [CASE-A_3216]
C4  10u  C-POLAR-A  [CASE-A_3216]
C5  100n  C-0603  [C0603]
C6  100n  C-0603  [C0603]
C7  10u  C-POLAR-A  [CASE-A_3216]
C8  10u  C-POLAR-A  [CASE-A_3216]
D1  1n4001  D-SMA  [DO-214AC]
D2  1n4001  D-SMA  [DO-214AC]
IC1  7809DT  7805DT  [TO252]
J2  POWERSHROUDED  [POWER_16_SHROUDED]
PCB1  EURORACK_PCB5STOMP  [EURORACK36HP_5STOMP]
R25  100k  R-0603  [R0603]
R26  100k  R-0603  [R0603]
U$13  VOLTAGETESTPAD  [POWERTESTPAD]
U$41  VOLTAGETESTPAD  [POWERTESTPAD]
U$42  VOLTAGETESTPAD  [POWERTESTPAD]
U$43  VOLTAGETESTPAD  [POWERTESTPAD]
U$44  VOLTAGETESTPAD  [POWERTESTPAD]
U$48  GNDLOOP  [GROUNDLOOP]
U$49  GNDLOOP  [GROUNDLOOP]
U$50  GNDLOOP  [GROUNDLOOP]

### Nets
4.5V [power]: R25.1 R26.2 U$44.P$1(VOLTAGE) U$44.P$2(VOLTAGE) U$44.P$3(VOLTAGE) ; also sheet 2
9V [power]: C5.2 C7.+ IC1.2(VO) R25.2 U$42.P$1(VOLTAGE) U$42.P$2(VOLTAGE) U$42.P$3(VOLTAGE) ; also sheet 2
12V [power]: C1.2 C3.+ C6.2 C8.+ D1.2(-) IC1.1(VI) U$13.P$1(VOLTAGE) U$13.P$2(VOLTAGE) U$13.P$3(VOLTAGE) ; also sheet 1,2,3
-12V [power]: C2.1 C4.- D2.1(+) U$41.P$1(VOLTAGE) U$41.P$2(VOLTAGE) U$41.P$3(VOLTAGE) ; also sheet 1,2,3
GND [power]: C1.1 C2.2 C3.- C4.+ C5.1 C6.1 C7.- C8.- IC1.3(GND) J2.3(GND) J2.4(GND) J2.5(GND) J2.6(GND) J2.7(GND) J2.8(GND) R26.1 U$43.P$1(VOLTAGE) U$43.P$2(VOLTAGE) U$43.P$3(VOLTAGE) U$48.P$1 U$48.P$2 U$49.P$1 U$49.P$2 U$50.P$1 U$50.P$2 ; also sheet 1,2,3
N$2: D1.1(+) J2.9(+12V) J2.10(+12V)
N$3: D2.2(-) J2.1(-12V) J2.2(-12V)
Unconnected: J2.11(+5V) J2.12(+5V) J2.13(CV) J2.14(CV) J2.15(GATE) J2.16(GATE)

## Library data of the parts
C1 C2 C5 C6 C9-C16 C18-C27 C30-C46 = OPL:C*
C3 C4 C7 C8 = EurorackModularParts:C-POLAR*
C17 C28 C29 = adafruit@1:CPOL-US: POLARIZED CAPACITOR, American symbol
D1 D2 = OPL:D*: DIODE
D3-D15 D17 D18 = FenixBase:BAS16W
D16 = EurorackModularParts:LED*: LED; DESC: InputLed
D19 = EurorackModularParts:LED*: LED; DESC: EnvelLed
D20 = EurorackModularParts:LED*: LED; DESC: OutputLed
IC1 = adafruit:78*: Positive VOLTAGE REGULATOR Added bigger pads to the TO-92 package
IC2-IC4 IC6-IC9 IC11 = EurorackModularParts:TL074: OP AMP
IC5 IC10 = ota:LM13700: Dual OTA with buffers
J1 = EurorackModularParts:AUDIO-JACK_SMALLSYMBOL: Switching Mono 3.5mm Audio Jack from Erthenvar.; DESC: VCA2in
J2 = EurorackModularParts:POWER
J3 = EurorackModularParts:AUDIO-JACK_SMALLSYMBOL: Switching Mono 3.5mm Audio Jack from Erthenvar.; DESC: Master Output
J4 = EurorackModularParts:AUDIO-JACK_SMALLSYMBOL: Switching Mono 3.5mm Audio Jack from Erthenvar.; DESC: Input B
J5 = EurorackModularParts:AUDIO-JACK_SMALLSYMBOL: Switching Mono 3.5mm Audio Jack from Erthenvar.; DESC: Difference B
J6 = EurorackModularParts:AUDIO-JACK_SMALLSYMBOL: Switching Mono 3.5mm Audio Jack from Erthenvar.; DESC: Input A
J7 = EurorackModularParts:AUDIO-JACK_SMALLSYMBOL: Switching Mono 3.5mm Audio Jack from Erthenvar.; DESC: Output A
J8 = EurorackModularParts:AUDIO-JACK_SMALLSYMBOL: Switching Mono 3.5mm Audio Jack from Erthenvar.; DESC: Difference A
J9 = EurorackModularParts:AUDIO-JACK_SMALLSYMBOL: Switching Mono 3.5mm Audio Jack from Erthenvar.; DESC: Output B
J10 = EurorackModularParts:AUDIO-JACK_SMALLSYMBOL: Switching Mono 3.5mm Audio Jack from Erthenvar.; DESC: Master Difference
J11 = EurorackModularParts:AUDIO-JACK_SMALLSYMBOL: Switching Mono 3.5mm Audio Jack from Erthenvar.; DESC: Input C
J12 = EurorackModularParts:AUDIO-JACK_SMALLSYMBOL: Switching Mono 3.5mm Audio Jack from Erthenvar.; DESC: Difference C
J13 = EurorackModularParts:AUDIO-JACK_SMALLSYMBOL: Switching Mono 3.5mm Audio Jack from Erthenvar.; DESC: Output C
J14 = EurorackModularParts:AUDIO-JACK_SMALLSYMBOL: Switching Mono 3.5mm Audio Jack from Erthenvar.; DESC: Input D
J15 = EurorackModularParts:AUDIO-JACK_SMALLSYMBOL: Switching Mono 3.5mm Audio Jack from Erthenvar.; DESC: Difference D
J16 = EurorackModularParts:AUDIO-JACK_SMALLSYMBOL: Switching Mono 3.5mm Audio Jack from Erthenvar.; DESC: Output D
J17 = EurorackModularParts:AUDIO-JACK_SMALLSYMBOL: Switching Mono 3.5mm Audio Jack from Erthenvar.; DESC: Input E
J18 = EurorackModularParts:AUDIO-JACK_SMALLSYMBOL: Switching Mono 3.5mm Audio Jack from Erthenvar.; DESC: Difference E
J19 = EurorackModularParts:AUDIO-JACK_SMALLSYMBOL: Switching Mono 3.5mm Audio Jack from Erthenvar.; DESC: Output E
J20 = EurorackModularParts:AUDIO-JACK_SMALLSYMBOL: Switching Mono 3.5mm Audio Jack from Erthenvar.; DESC: Master Input
J21 = EurorackModularParts:AUDIO-JACK_SMALLSYMBOL: Switching Mono 3.5mm Audio Jack from Erthenvar.; DESC: Drive CV
J22 = EurorackModularParts:AUDIO-JACK_SMALLSYMBOL: Switching Mono 3.5mm Audio Jack from Erthenvar.; DESC: Mod
J23 = EurorackModularParts:AUDIO-JACK_SMALLSYMBOL: Switching Mono 3.5mm Audio Jack from Erthenvar.; DESC: Bias
J24 = EurorackModularParts:AUDIO-JACK_SMALLSYMBOL: Switching Mono 3.5mm Audio Jack from Erthenvar.; DESC: Envelope Out
J25 = EurorackModularParts:AUDIO-JACK_SMALLSYMBOL: Switching Mono 3.5mm Audio Jack from Erthenvar.; DESC: Wet/Dry
J26 = EurorackModularParts:AUDIO-JACK_SMALLSYMBOL: Switching Mono 3.5mm Audio Jack from Erthenvar.; DESC: Cross Output
J27 = EurorackModularParts:AUDIO-JACK_SMALLSYMBOL: Switching Mono 3.5mm Audio Jack from Erthenvar.; DESC: Sum Out
PCB1 = EurorackModularParts:EURORACK_PCB
Q1 Q3 Q4 = transistor-pnp:MMBT3906*: PNP Transistror
R1-R48 R51-R68 R70-R108 R110-R113 R115-R121 = OPL:R*
R49 = EurorackModularParts:POT; DESC: Mod
R50 = EurorackModularParts:POT; DESC: Level
R69 = EurorackModularParts:POT; DESC: Drive
R109 = EurorackModularParts:POT; DESC: Post-gain
R114 = EurorackModularParts:POT; DESC: Wet/Dry
T1 = transistor:*-PNP-: PNP Transistror
TR_IN_A TR_IN_B TR_IN_C TR_IN_D TR_OUT_A TR_OUT_B TR_OUT_C TR_OUT_D U$70 U$71 U$93 U$111 U$112 = adafruit:TRIMPOT: SMT trimmer potentiometer part number TC33X http://www.ladyada.net/library/eagle
U$13 = FenixBase:VOLTAGETESTPAD; DESC: 12V
U$15 = FenixBase:VOLTAGETESTPAD; DESC: volt
U$22 = EurorackModularParts:5STOMPBOARD
U$23 = EurorackModularParts:HEADPHONEHOLE
U$41 = FenixBase:VOLTAGETESTPAD; DESC: -12V
U$42 = FenixBase:VOLTAGETESTPAD; DESC: 9V
U$43 = FenixBase:VOLTAGETESTPAD; DESC: GND
U$44 = FenixBase:VOLTAGETESTPAD; DESC: 4.5V
U$48-U$50 = FenixBase:GNDLOOP
U$68 = SparkFun-Connectors:HEADPHONE
U$74 = FenixBase:BAT54S
U$92 = FenixBase:TESTPOINT_DUAL

## Module ACID
Ports: INPUT_A(io) OUTPUT_A(io) 12V(io) GND(io) -12V(io) 9V(io) +4.5V(io)
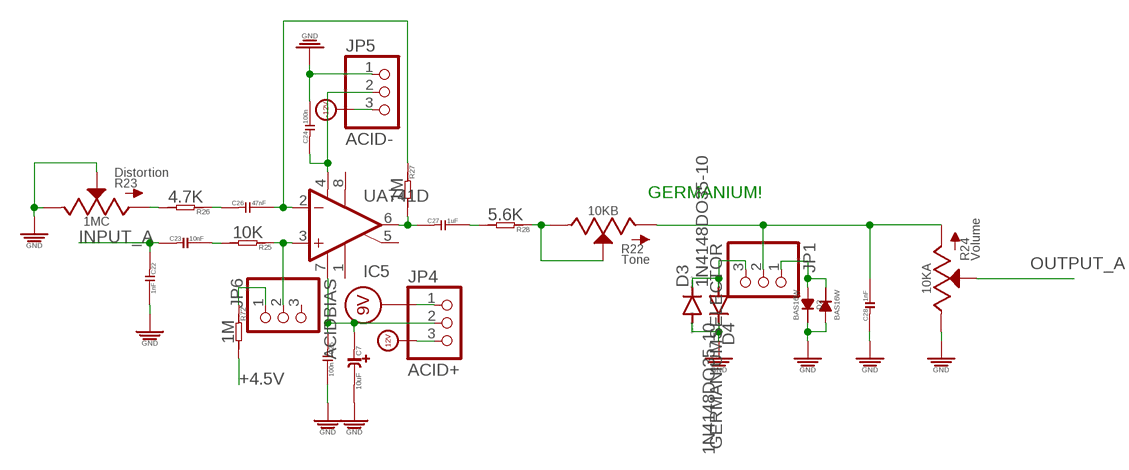
[diagram p6: schematic, module ACID, sheet 1]

### Parts
C7  10uF  C-POLAR-A  [CASE-A_3216]
C22  1nF  C-0603  [C0603]
C23  10nF  C-0603  [C0603]
C24  100n  C-0603  [C0603]
C25  100n  C-0603  [C0603]
C26  47nF  C-0603  [C0603]
C27  1uF  C-0603  [C0603]
C28  1nF  C-0603  [C0603]
D1  BAS16W  [SOT-323]
D2  BAS16W  [SOT-323]
D3  1N4148DO35-10  [DO35-10]
D4  1N4148DO35-10  [DO35-10]
IC5  UA741D  [SO08]
JP1  GERMANIUMSELECTOR  PINHD-1X3  [1X03]
JP4  ACID+  PINHD-1X3  [1X03]
JP5  ACID-  PINHD-1X3  [1X03]
JP6  ACIDBIAS  PINHD-1X3  [1X03]
R22  10KB  POTSQUAREHOLE_SMALLKNOB  [ALPS_POT_SQUAREHOLES]
R23  1MC  POTSQUAREHOLE_SMALLKNOB  [ALPS_POT_SQUAREHOLES]
R24  10KA  POTSQUAREHOLE_SMALLKNOB  [ALPS_POT_SQUAREHOLES]
R25  10K  R-0603  [R0603]
R26  4.7K  R-0603  [R0603]
R27  1M  R-0603  [R0603]
R28  5.6K  R-0603  [R0603]
R72  1M  R-0603  [R0603]

### Nets
9V: JP4.1
12V: JP4.3
+4.5V: R72.2
-12V: JP5.3
ACIDNE: C24.1 IC5.4(V-) JP5.2
ACIDPL: C7.+ C25.1 IC5.7(V+) JP4.2
ACIDVI: IC5.3(+IN) JP6.2 R25.1
GND: C7.- C22.2 C24.2 C25.2 C28.1 D1.ANODE D2.CATHODE D3.A D4.C JP5.1 R23.P$1(E) R23.P$2(S) R24.P$1(E)
INPUT_A: C22.1 C23.1
N$2: D3.C D4.A JP1.3
N$3: D1.CATHODE D2.ANODE JP1.1
N$20: C23.2 R25.2
N$22: C26.2 IC5.2(-IN) R27.1
N$23: C26.1 R26.1
N$32: C27.1 IC5.6(OUT) R27.2
N$33: R23.P$3(A) R26.2
N$34: C28.2 JP1.2 R22.P$3(A) R24.P$3(A)
N$35: C27.2 R28.2
N$36: R22.P$1(E) R22.P$2(S) R28.1
OUTPUT_A: R24.P$2(S)
TO4.5V: JP6.1 R72.1
Unconnected: IC5.1(ON1) IC5.5(ON2) IC5.8(OPT) JP6.3

### Notes on the sheet
- GERMANIUM!

### Library data of the parts
C7 = EurorackModularParts:C-POLAR*
C22-C28 = OPL:C*
D1 D2 = FenixBase:BAS16W
D3 D4 = diode:1N4148: DIODE high speed (Philips)
IC5 = linear:*741: OP AMP
JP1 = pinhead@1:PINHD-1X3: PIN HEADER
JP4-JP6 = pinhead:PINHD-1X3: PIN HEADER
R22 = EurorackModularParts:POT; DESC: Tone
R23 = EurorackModularParts:POT; DESC: Distortion
R24 = EurorackModularParts:POT; DESC: Volume
R25-R28 R72 = OPL:R*

## Module CLIP
Ports: INPUT_B(io) OUTPUT_B(io) 12V(io) GND(io) -12V(io) 9V(io) +4.5V(io)
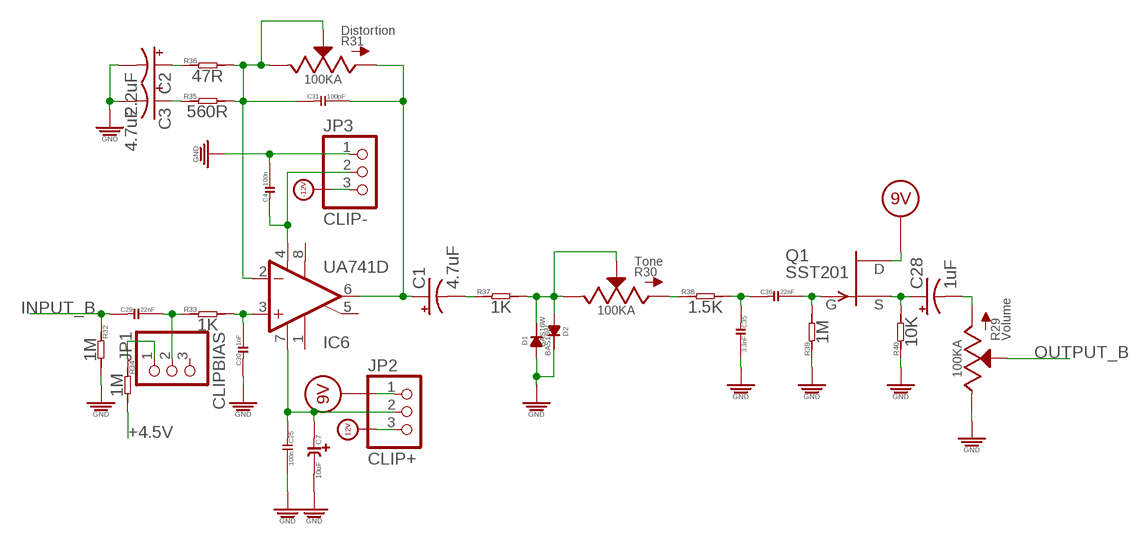
[diagram p7: schematic, module CLIP, sheet 1]

### Parts
C1  4.7uF  CPOL-US153CLV-0505  [153CLV-0505]
C2  2.2uF  CPOL-US153CLV-0505  [153CLV-0505]
C3  4.7uF  CPOL-US153CLV-0505  [153CLV-0505]
C4  100n  C-0603  [C0603]
C7  10uF  C-POLAR-A  [CASE-A_3216]
C25  100n  C-0603  [C0603]
C28  1uF  CPOL-US153CLV-0505  [153CLV-0505]
C29  22nF  C-0603  [C0603]
C30  1nF  C-0603  [C0603]
C31  100pF  C-0603  [C0603]
C35  3.3nF  C-0603  [C0603]
C36  22nF  C-0603  [C0603]
D1  BAS16W  [SOT-323]
D2  BAS16W  [SOT-323]
IC6  UA741D  [SO08]
JP1  CLIPBIAS  PINHD-1X3  [1X03]
JP2  CLIP+  PINHD-1X3  [1X03]
JP3  CLIP-  PINHD-1X3  [1X03]
Q1  SST201  [SOT23]
R29  100KA  POTSQUAREHOLE_SMALLKNOB  [ALPS_POT_SQUAREHOLES]
R30  100KA  POTSQUAREHOLE_SMALLKNOB  [ALPS_POT_SQUAREHOLES]
R31  100KA  POTSQUAREHOLE_SMALLKNOB  [ALPS_POT_SQUAREHOLES]
R32  1M  R-0603  [R0603]
R33  1K  R-0603  [R0603]
R34  1M  R-0603  [R0603]
R35  560R  R-0603  [R0603]
R36  47R  R-0603  [R0603]
R37  1K  R-0603  [R0603]
R38  1.5K  R-0603  [R0603]
R39  1M  R-0603  [R0603]
R40  10K  R-0603  [R0603]

### Nets
9V: JP2.1 Q1.1(D) ; supply symbol labelled CLIP+
12V: JP2.3
+4.5V: R34.2
-12V: JP3.3
CLIPNE: C4.1 IC6.4(V-) JP3.2
CLIPPL: C7.+ C25.1 IC6.7(V+) JP2.2
CLIPVI: C29.2 JP1.2 R33.1
GND: C2.- C3.- C4.2 C7.- C25.2 C30.1 C35.2 D1.ANODE D2.CATHODE JP3.1 R29.P$1(E) R32.2 R39.1 R40.1
INPUT_B: C29.1 R32.1
N$38: C30.2 IC6.3(+IN) R33.2
N$41: JP1.1 R34.1
N$42: C31.1 IC6.2(-IN) R31.P$1(E) R31.P$2(S) R35.2 R36.2
N$43: C1.+ C31.2 IC6.6(OUT) R31.P$3(A)
N$44: C1.- R37.1
N$45: D1.CATHODE D2.ANODE R30.P$1(E) R30.P$2(S) R37.2
N$46: R30.P$3(A) R38.1
N$47: C2.+ R36.1
N$48: C3.+ R35.1
N$49: C35.1 C36.1 R38.2
N$50: C36.2 Q1.3(G) R39.2
N$51: C28.+ Q1.2(S) R40.2
N$52: C28.- R29.P$3(A)
OUTPUT_B: R29.P$2(S)
Unconnected: IC6.1(ON1) IC6.5(ON2) IC6.8(OPT) JP1.3

### Library data of the parts
C1-C3 C28 = adafruit@1:CPOL-US: POLARIZED CAPACITOR, American symbol
C4 C25 C29-C31 C35 C36 = OPL:C*
C7 = EurorackModularParts:C-POLAR*
D1 D2 = FenixBase:BAS16W
IC6 = linear:*741: OP AMP
JP1-JP3 = pinhead:PINHD-1X3: PIN HEADER
Q1 = transistor-fet:?20*: TEMIC / Siliconix N-Channel JFET Source: JFET-J201_Siliconix_data.pdf
R29 = EurorackModularParts:POT; DESC: Volume
R30 = EurorackModularParts:POT; DESC: Tone
R31 = EurorackModularParts:POT; DESC: Distortion
R32-R40 = OPL:R*

## Module FUZZ
Ports: INPUT_C(io) OUTPUT_C(io) 9V(io) GND(io)
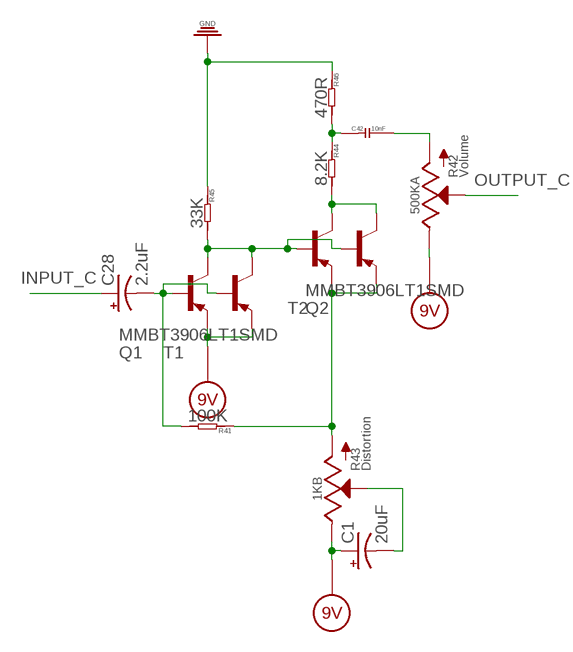
[diagram p8: schematic, module FUZZ, sheet 1]

### Parts
C1  20uF  CPOL-US153CLV-0505  [153CLV-0505]
C28  2.2uF  CPOL-US153CLV-0505  [153CLV-0505]
C42  10nF  C-0603  [C0603]
Q1  MMBT3906LT1SMD  [SOT23-BEC]
Q2  MMBT3906LT1SMD  [SOT23-BEC]
R41  100K  R-0603  [R0603]
R42  500KA  POTSQUAREHOLE_SMALLKNOB  [ALPS_POT_SQUAREHOLES]
R43  1KB  POTSQUAREHOLE_SMALLKNOB  [ALPS_POT_SQUAREHOLES]
R44  8.2K  R-0603  [R0603]
R45  33K  R-0603  [R0603]
R46  470R  R-0603  [R0603]
T1  2N3906-PNP-TO92-EBC  [TO92-EBC]
T2  2N3906-PNP-TO92-EBC  [TO92-EBC]

### Nets
9V: C1.+ Q1.E R42.P$1(E) R43.P$1(E) T1.E
GND: R45.1 R46.1
INPUT_C: C28.+
N$53: Q2.E R41.1 R43.P$3(A) T2.E
N$54: C28.- Q1.B R41.2 T1.B
N$55: Q1.C Q2.B R45.2 T1.C T2.B
N$56: C1.- R43.P$2(S)
N$57: C42.2 R42.P$3(A)
N$58: C42.1 R44.1 R46.2
N$59: Q2.C R44.2 T2.C
OUTPUT_C: R42.P$2(S)

### Library data of the parts
C1 C28 = adafruit@1:CPOL-US: POLARIZED CAPACITOR, American symbol
C42 = OPL:C*
Q1 Q2 = transistor-pnp:MMBT3906*: PNP Transistror
R41 R44-R46 = OPL:R*
R42 = EurorackModularParts:POT; DESC: Volume
R43 = EurorackModularParts:POT; DESC: Distortion
T1 T2 = transistor-neu-to92@1:*-PNP-: PNP Transistror

## Module CREAM
Ports: INPUT_D(io) OUTPUT_D(io) 9V(io) GND(io)
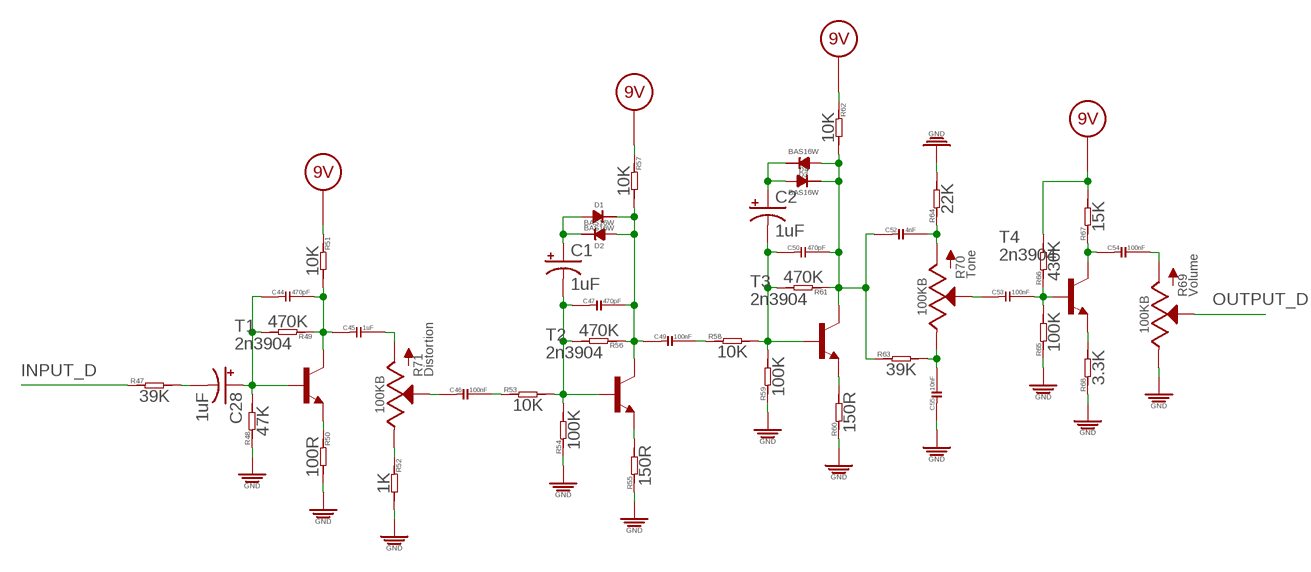
[diagram p9: schematic, module CREAM, sheet 1]

### Parts
C1  1uF  CPOL-US153CLV-0505  [153CLV-0505]
C2  1uF  CPOL-US153CLV-0505  [153CLV-0505]
C28  1uF  CPOL-US153CLV-0505  [153CLV-0505]
C44  470pF  C-0603  [C0603]
C45  1uF  C-0603  [C0603]
C46  100nF  C-0603  [C0603]
C47  470pF  C-0603  [C0603]
C49  100nF  C-0603  [C0603]
C50  470pF  C-0603  [C0603]
C52  4nF  C-0603  [C0603]
C53  100nF  C-0603  [C0603]
C54  100nF  C-0603  [C0603]
C55  10nF  C-0603  [C0603]
D1  BAS16W  [SOT-323]
D2  BAS16W  [SOT-323]
D3  BAS16W  [SOT-323]
D4  BAS16W  [SOT-323]
R47  39K  R-0603  [R0603]
R48  47K  R-0603  [R0603]
R49  470K  R-0603  [R0603]
R50  100R  R-0603  [R0603]
R51  10K  R-0603  [R0603]
R52  1K  R-0603  [R0603]
R53  10K  R-0603  [R0603]
R54  100K  R-0603  [R0603]
R55  150R  R-0603  [R0603]
R56  470K  R-0603  [R0603]
R57  10K  R-0603  [R0603]
R58  10K  R-0603  [R0603]
R59  100K  R-0603  [R0603]
R60  150R  R-0603  [R0603]
R61  470K  R-0603  [R0603]
R62  10K  R-0603  [R0603]
R63  39K  R-0603  [R0603]
R64  22K  R-0603  [R0603]
R65  100K  R-0603  [R0603]
R66  430K  R-0603  [R0603]
R67  15K  R-0603  [R0603]
R68  3.3K  R-0603  [R0603]
R69  100KB  POTSQUAREHOLE_SMALLKNOB  [ALPS_POT_SQUAREHOLES]
R70  100KB  POTSQUAREHOLE_SMALLKNOB  [ALPS_POT_SQUAREHOLES]
R71  100KB  POTSQUAREHOLE_SMALLKNOB  [ALPS_POT_SQUAREHOLES]
T1  2n3904  MMBT3904LT1-NPN-SOT23-BEC  [SOT23-BEC]
T2  2n3904  MMBT3904LT1-NPN-SOT23-BEC  [SOT23-BEC]
T3  2n3904  MMBT3904LT1-NPN-SOT23-BEC  [SOT23-BEC]
T4  2n3904  MMBT3904LT1-NPN-SOT23-BEC  [SOT23-BEC]

### Nets
9V: R51.1 R57.1 R62.1 R66.2 R67.2
GND: C55.1 R48.1 R50.2 R52.2 R54.1 R55.1 R59.1 R60.1 R64.2 R65.1 R68.1 R69.P$1(E)
INPUT_D: R47.1
N$1: C28.- R47.2
N$61: C28.+ C44.1 R48.2 R49.2 T1.B
N$62: R50.1 T1.E
N$63: C44.2 C45.1 R49.1 R51.2 T1.C
N$64: C45.2 R71.P$3(A)
N$65: C1.- C47.1 R53.2 R54.2 R56.2 T2.B
N$66: C1.+ D1.ANODE D2.CATHODE
N$67: R55.2 T2.E
N$68: C47.2 C49.1 D1.CATHODE D2.ANODE R56.1 R57.2 T2.C
N$69: C49.2 R58.1
N$70: C2.- C50.1 R58.2 R59.2 R61.2 T3.B
N$71: R60.2 T3.E
N$72: C50.2 C52.1 D3.ANODE D4.CATHODE R61.1 R62.2 R63.1 T3.C
N$73: C53.1 R70.P$2(S)
N$74: C55.2 R63.2 R70.P$1(E)
N$75: C52.2 R64.1 R70.P$3(A)
N$76: C2.+ D3.CATHODE D4.ANODE
N$77: C53.2 R65.2 R66.1 T4.B
N$78: C54.1 R67.1 T4.C
N$79: R68.2 T4.E
N$80: C54.2 R69.P$3(A)
N$84: R52.1 R71.P$1(E)
N$85: C46.2 R53.1
N$86: C46.1 R71.P$2(S)
OUTPUT_D: R69.P$2(S)

### Library data of the parts
C1 C2 C28 = adafruit@1:CPOL-US: POLARIZED CAPACITOR, American symbol
C44-C47 C49 C50 C52-C55 = OPL:C*
D1-D4 = FenixBase:BAS16W
R47-R68 = OPL:R*
R69 = EurorackModularParts:POT; DESC: Volume
R70 = EurorackModularParts:POT; DESC: Tone
R71 = EurorackModularParts:POT; DESC: Distortion
T1-T4 = transistor-neu-to92:*-NPN-: NPN Transistror

## Net classes
0 default: width 0.254 mm
1 power: width 0.381 mm